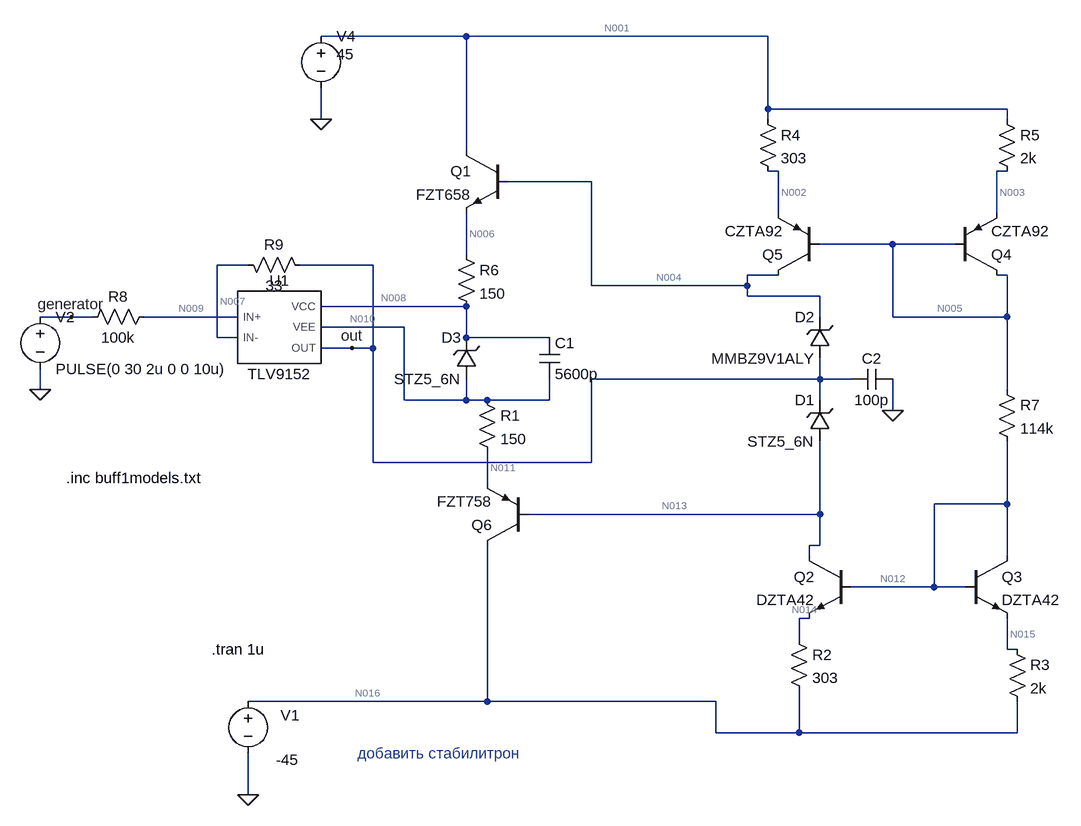
[diagram p0: schematic FullBufferReadyTLV9152.asc]
FullBufferReadyTLV9152.asc, the LTspice schematic file:
Version 4
SHEET 1 1192 772
WIRE -48 -416 -272 -416
WIRE 416 -416 -48 -416
WIRE 416 -304 416 -416
WIRE 784 -304 416 -304
WIRE -272 -288 -272 -336
WIRE 416 -288 416 -304
WIRE 784 -288 784 -304
WIRE -48 -240 -48 -416
WIRE 432 -208 416 -208
WIRE 784 -208 768 -208
WIRE 144 -192 16 -192
WIRE 432 -144 432 -208
WIRE 768 -144 768 -208
WIRE 608 -96 496 -96
WIRE 704 -96 608 -96
WIRE -48 -80 -48 -144
WIRE -384 -64 -432 -64
WIRE -192 -64 -304 -64
WIRE 432 -48 384 -48
WIRE 784 -48 768 -48
WIRE 144 -32 144 -192
WIRE 384 -32 384 -48
WIRE 384 -32 144 -32
WIRE 384 -16 384 -32
WIRE 496 -16 384 -16
WIRE -48 0 -272 0
WIRE -656 16 -704 16
WIRE -624 16 -656 16
WIRE -400 16 -544 16
WIRE 496 16 496 -16
WIRE 608 16 608 -96
WIRE 784 16 784 -48
WIRE 784 16 608 16
WIRE -144 32 -272 32
WIRE -432 48 -432 -64
WIRE -400 48 -432 48
WIRE -48 48 -48 0
WIRE 80 48 -48 48
WIRE -224 64 -272 64
WIRE -192 64 -192 -64
WIRE -192 64 -224 64
WIRE 496 112 496 80
WIRE 496 112 144 112
WIRE 544 112 496 112
WIRE -704 128 -704 96
WIRE 784 128 784 16
WIRE -144 144 -144 32
WIRE -48 144 -48 112
WIRE -48 144 -144 144
WIRE -16 144 -48 144
WIRE 80 144 80 112
WIRE 80 144 -16 144
WIRE 496 144 496 112
WIRE 608 160 608 112
WIRE -192 240 -192 64
WIRE 144 240 144 112
WIRE 144 240 -192 240
WIRE -16 272 -16 224
WIRE 784 304 784 208
WIRE 784 304 672 304
WIRE 496 320 496 208
WIRE 496 320 48 320
WIRE 496 368 496 320
WIRE 496 368 480 368
WIRE 480 384 480 368
WIRE 784 384 784 304
WIRE 672 432 672 304
WIRE 672 432 544 432
WIRE 720 432 672 432
WIRE 480 480 464 480
WIRE 464 512 464 480
WIRE 784 528 784 480
WIRE 800 528 784 528
WIRE -16 608 -16 368
WIRE -16 608 -384 608
WIRE 336 608 -16 608
WIRE 336 656 336 608
WIRE 464 656 464 592
WIRE 464 656 336 656
WIRE 800 656 800 608
WIRE 800 656 464 656
WIRE -384 752 -384 688
FLAG -272 -288 0
FLAG -384 752 0
FLAG -224 64 out
FLAG 608 160 0
FLAG -704 128 0
FLAG -656 16 generator
DATAFLAG 336 -416 ""
DATAFLAG 416 656 ""
DATAFLAG 784 496 ""
DATAFLAG 464 480 ""
DATAFLAG 768 -176 ""
DATAFLAG 432 -192 ""
DATAFLAG 784 80 ""
DATAFLAG 256 112 ""
SYMBOL voltage -272 -432 R0
WINDOW 123 0 0 Left 0
WINDOW 39 0 0 Left 0
WINDOW 3 24 44 Left 2
SYMATTR Value 45
SYMATTR InstName V4
SYMBOL npn 544 384 M0
SYMATTR InstName Q2
SYMATTR Value DZTA42
SYMBOL npn 720 384 R0
SYMATTR InstName Q3
SYMATTR Value DZTA42
SYMBOL pnp 704 -48 M180
SYMATTR InstName Q4
SYMATTR Value CZTA92
SYMBOL pnp 496 -48 R180
SYMATTR InstName Q5
SYMATTR Value CZTA92
SYMBOL res 448 496 R0
SYMATTR InstName R2
SYMATTR Value 303
SYMBOL res 784 512 R0
SYMATTR InstName R3
SYMATTR Value 2k
SYMBOL res 400 -304 R0
SYMATTR InstName R4
SYMATTR Value 303
SYMBOL res 768 -304 R0
SYMATTR InstName R5
SYMATTR Value 2k
SYMBOL zener 512 208 R180
WINDOW 0 24 64 Left 2
WINDOW 3 24 0 Left 2
SYMATTR InstName D1
SYMATTR Value STZ5_6N
SYMATTR Description Diode
SYMATTR Type diode
SYMBOL zener 512 80 R180
WINDOW 0 24 64 Left 2
WINDOW 3 24 0 Left 2
SYMATTR InstName D2
SYMATTR Value MMBZ9V1ALY
SYMATTR Description Diode
SYMATTR Type diode
SYMBOL res 768 112 R0
SYMATTR InstName R7
SYMATTR Value 114k
SYMBOL voltage -384 592 R0
WINDOW 123 0 0 Left 0
WINDOW 39 0 0 Left 0
WINDOW 0 50 37 Left 2
WINDOW 3 43 106 Left 2
SYMATTR InstName V1
SYMATTR Value -45
SYMBOL npn 16 -240 M0
SYMATTR InstName Q1
SYMATTR Value FZT658
SYMBOL pnp 48 368 R180
SYMATTR InstName Q6
SYMATTR Value FZT758
SYMBOL res -32 128 R0
SYMATTR InstName R1
SYMATTR Value 150
SYMBOL zener -32 112 R180
WINDOW 0 24 64 Left 2
WINDOW 3 24 0 Left 2
SYMATTR InstName D3
SYMATTR Value STZ5_6N
SYMATTR Description Diode
SYMATTR Type diode
SYMBOL res -64 -96 R0
SYMATTR InstName R6
SYMATTR Value 150
SYMBOL cap 544 96 M90
WINDOW 0 0 32 VBottom 2
WINDOW 3 32 32 VTop 2
SYMATTR InstName C2
SYMATTR Value 100p
SYMBOL voltage -704 0 R0
WINDOW 123 0 0 Left 0
WINDOW 39 0 0 Left 0
SYMATTR InstName V2
SYMATTR Value PULSE(0 30 2u 0 0 10u)
SYMBOL res -528 0 R90
WINDOW 0 0 56 VBottom 2
WINDOW 3 32 56 VTop 2
SYMATTR InstName R8
SYMATTR Value 100k
SYMBOL TLV9152 -336 32 R0
SYMATTR InstName U1
SYMBOL res -400 -80 M90
WINDOW 0 0 56 VBottom 2
WINDOW 3 32 56 VTop 2
SYMATTR InstName R9
SYMATTR Value 33
SYMBOL cap 64 48 R0
SYMATTR InstName C1
SYMATTR Value 5600p
TEXT -440 528 Left 2 !.tran 1u
TEXT -216 688 Left 2 ;добавить стабилитрон
TEXT -664 264 Left 2 !.inc buff1models.txt

The netlist it stands for:
* FullBufferReadyTLV9152.asc
V4 N001 0 45
Q2 N013 N012 N014 0 DZTA42
Q3 N012 N012 N015 0 DZTA42
Q4 N005 N005 N003 0 CZTA92
Q5 N004 N005 N002 0 CZTA92
R2 N014 N016 303
R3 N015 N016 2k
R4 N001 N002 303
R5 N001 N003 2k
D1 N013 out STZ5_6N
D2 out N004 MMBZ9V1ALY
R7 N005 N012 114k
V1 N016 0 -45
Q1 N001 N004 N006 0 FZT658
Q6 N016 N013 N011 0 FZT758
R1 N010 N011 150
D3 N010 N008 STZ5_6N
R6 N006 N008 150
C2 out 0 100p
V2 generator 0 PULSE(0 30 2u 0 0 10u)
R8 N009 generator 100k
XU1 N009 N007 N008 N010 out TLV9152  ; pins IN+ IN- VCC VEE OUT
R9 N007 out 33
C1 N008 N010 5600p
.model D D
.lib standard.dio
.model NPN NPN
.model PNP PNP
.lib standard.bjt
.tran 1u
* добавить стабилитрон
.inc buff1models.txt
.lib tlv9152.lib
.backanno
.end

* Results of the author's LTspice run, read from the files saved beside the schematic
* Operating Point, zero values left out:
*   V(n001) = 45 V
*   V(n013) = -5.61 V
*   V(n012) = -42.92 V
*   V(n014) = -43.61 V
*   V(n015) = -43.56 V
*   V(n005) = 42.94 V
*   V(n003) = 43.56 V
*   V(n004) = 9.121 V
*   V(n002) = 43.58 V
*   V(n016) = -45 V
*   V(out) = 123.2 µV
*   V(n006) = 8.448 V
*   V(n011) = -4.939 V
*   V(n010) = -1.05 V
*   V(n008) = 4.578 V
*   V(n009) = -118.1 nV
*   V(n007) = 123.2 µV
*   Ic(Q6) = -25.74 mA
*   Ib(Q6) = -181.8 µA
*   Ie(Q6) = 25.92 mA
*   Ic(Q1) = 25.65 mA
*   Ib(Q1) = 153 µA
*   Ie(Q1) = -25.8 mA
*   Ic(Q5) = -4.661 mA
*   Ib(Q5) = -33.9 µA
*   Ie(Q5) = 4.695 mA
*   Ic(Q4) = -699.1 µA
*   Ib(Q4) = -20.19 µA
*   Ie(Q4) = 719.3 µA
*   Ic(Q3) = 716.9 µA
*   Ib(Q3) = 5.183 µA
*   Ie(Q3) = -722 µA
*   Ic(Q2) = 4.57 mA
*   Ib(Q2) = 31.17 µA
*   Ie(Q2) = -4.601 mA
*   I(D2) = -4.508 mA
*   I(D3) = -25.24 mA
*   I(D1) = -4.388 mA
*   I(R9) = 8.818 pA
*   I(R8) = -1.181 pA
*   I(R6) = 25.8 mA
*   I(R1) = 25.92 mA
*   I(R7) = 753.2 µA
*   I(R5) = 719.3 µA
*   I(R4) = 4.695 mA
*   I(R3) = 722 µA
*   I(R2) = 4.601 mA
*   I(V2) = -1.181 pA
*   I(V1) = 31.06 mA
*   I(V4) = -31.06 mA
*   Ix(u1:IN+) = 1.181 pA
*   Ix(u1:IN-) = -8.818 pA
*   Ix(u1:VCC) = 560 µA
*   Ix(u1:VEE) = -680.2 µA
*   Ix(u1:OUT) = 120.2 µA
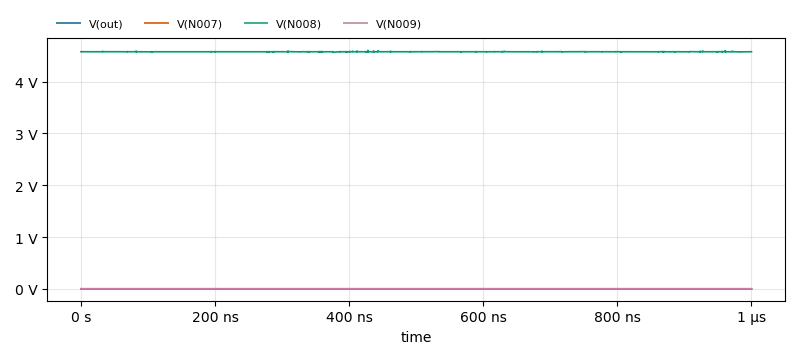
[diagram p1: Transient Analysis of FullBufferReadyTLV9152.asc, plotted from the saved traces]
* Transient Analysis, 1 run:
*   V(out): min 123.1 µV, max 123.4 µV, average 123.3 µV, rms 123.3 µV, last 123.2 µV
*   V(N007): min 123.1 µV, max 123.4 µV, average 123.3 µV, rms 123.3 µV, last 123.2 µV
*   V(N008): min 4.565 V, max 4.604 V, average 4.578 V, rms 4.578 V, last 4.578 V
*   V(N009): min -144.5 nV, max 71.4 nV, average -20.81 nV, rms 67.88 nV, last -86.49 nV